# EAGLE design RadioMusic (EAGLE 6.6.0)
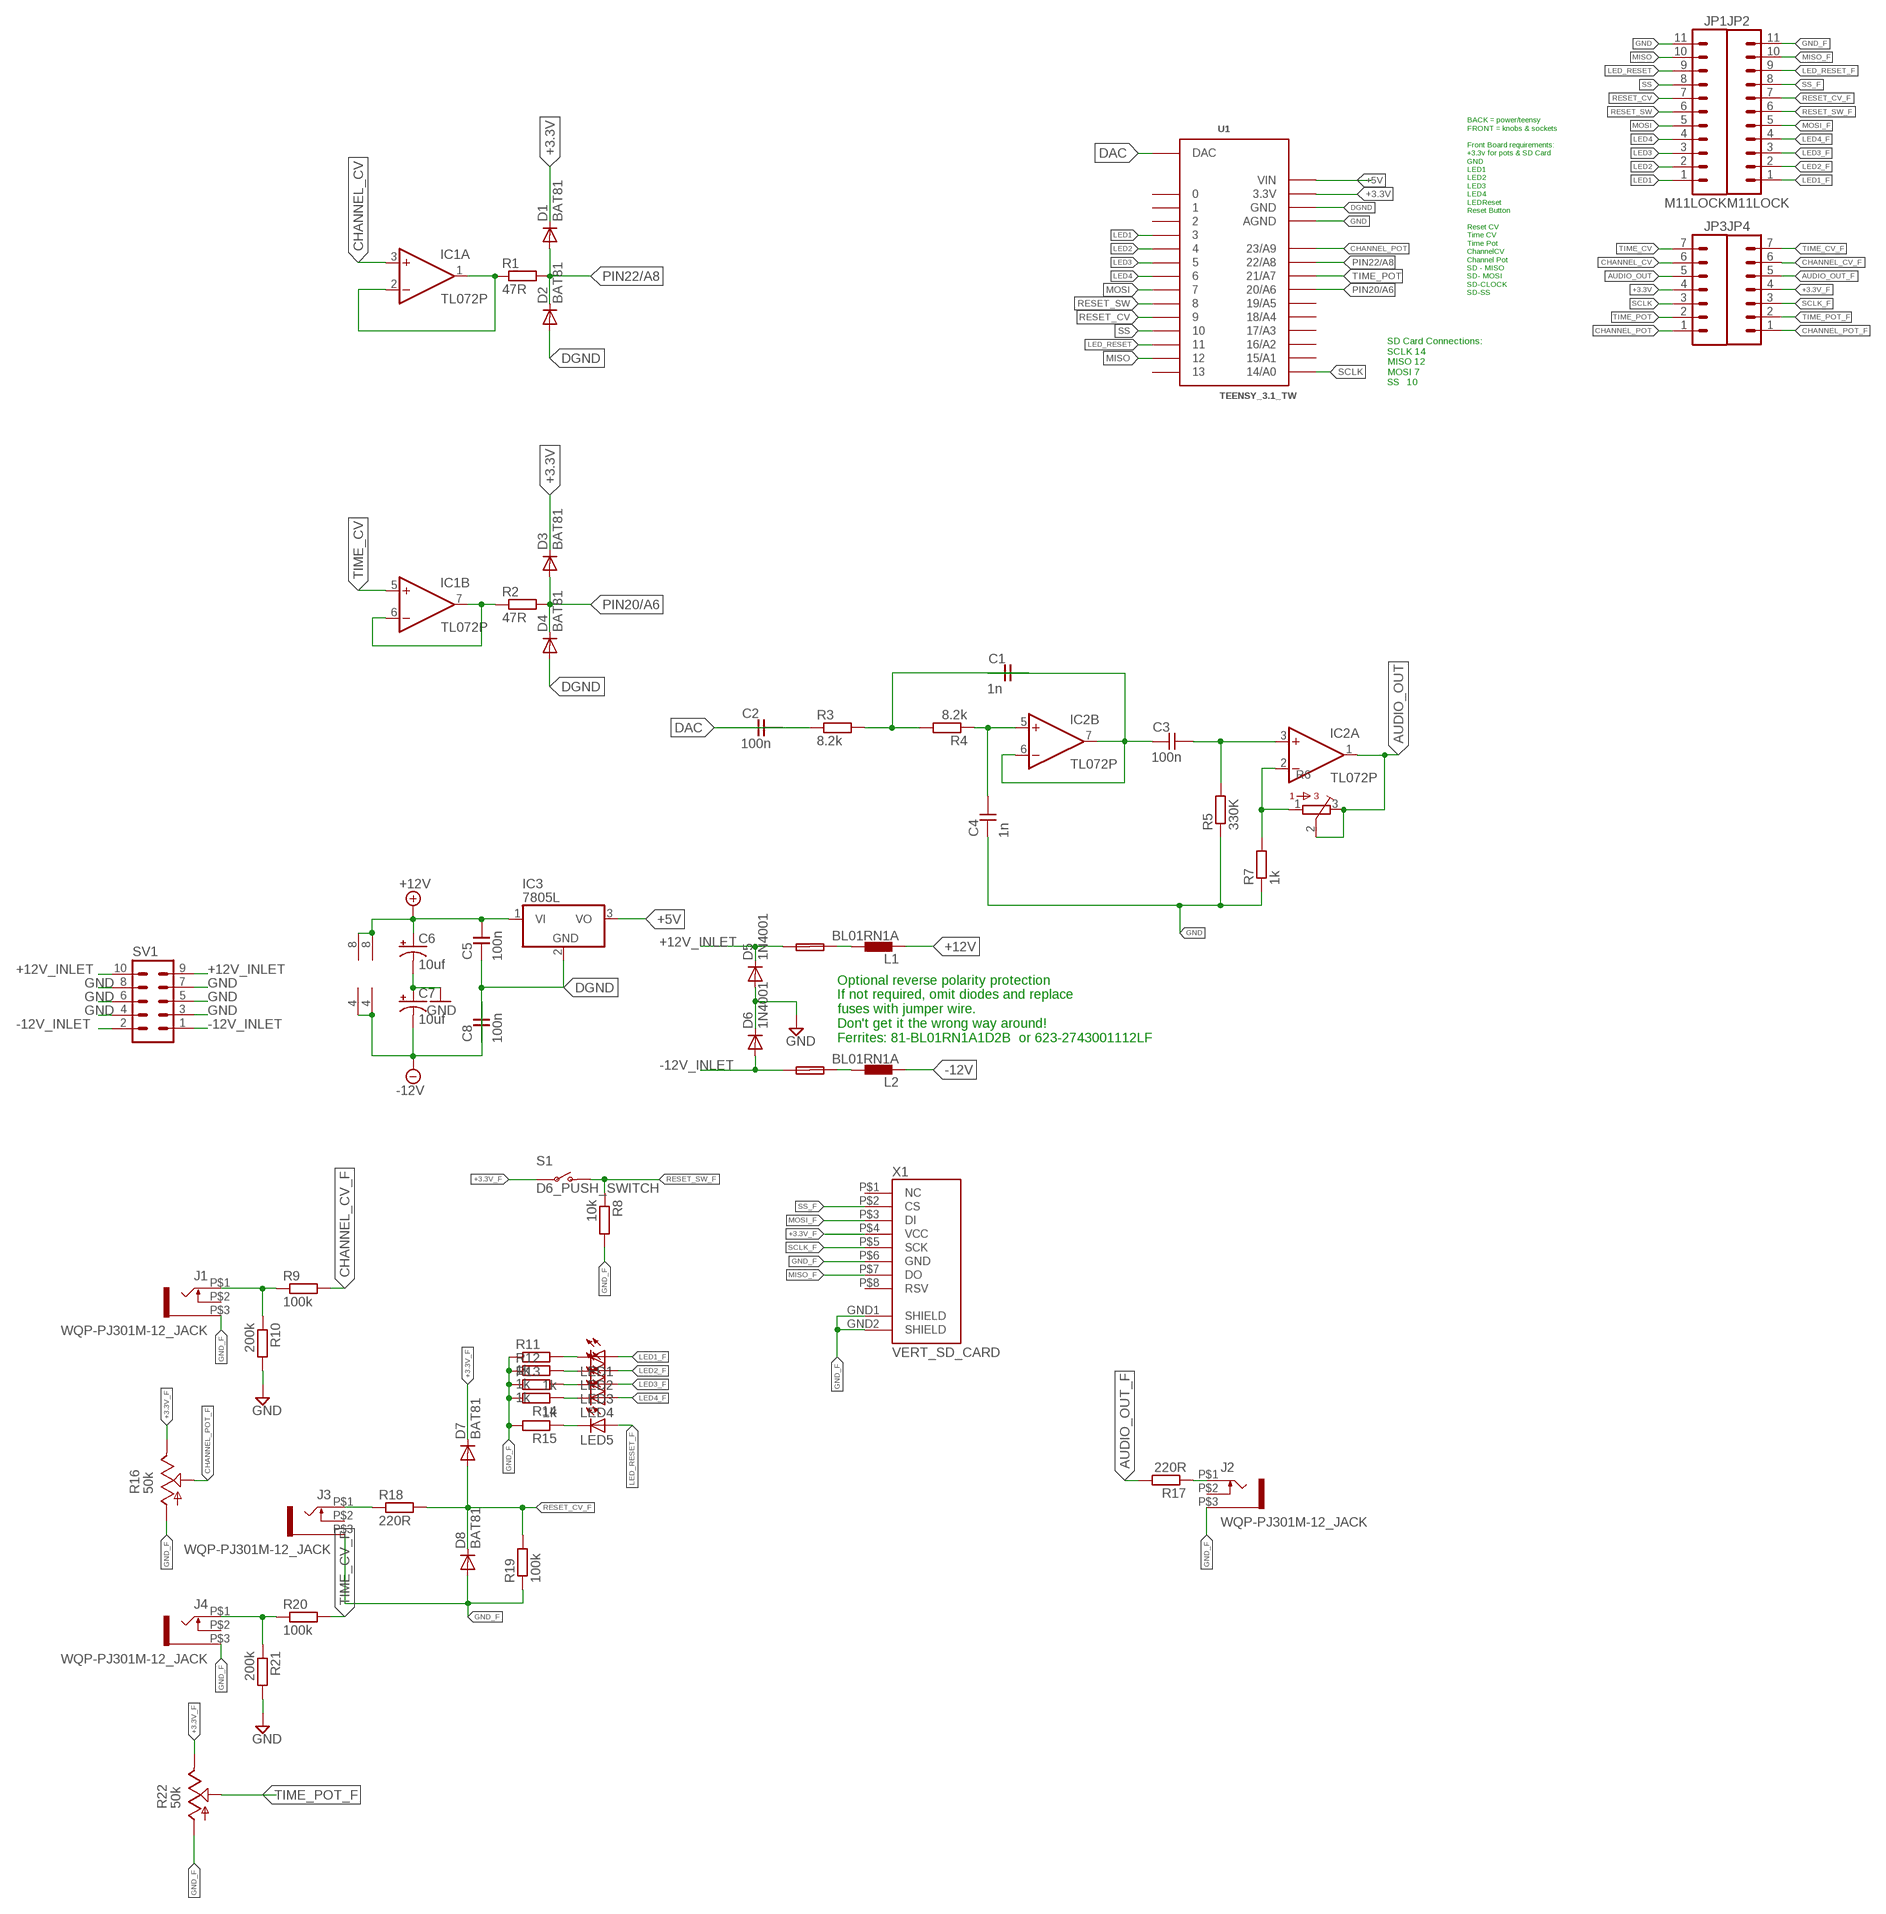
[diagram p0: schematic, sheet 1]

## Parts
C1  1n  C-EU050-024X044  [C050-024X044]
C2  100n  C-EU050-025X075  [C050-025X075]
C3  100n  C-EU050-025X075  [C050-025X075]
C4  1n  C-EU050-024X044  [C050-024X044]
C5  100n  C-EU050-024X044  [C050-024X044]
C6  10uf  CAP_POLPTH2  [CPOL-RADIAL-10UF-25V]
C7  10uf  CAP_POLPTH2  [CPOL-RADIAL-10UF-25V]
C8  100n  C-EU050-024X044  [C050-024X044]
D1  BAT81  [DO34-7]
D2  BAT81  [DO34-7]
D3  BAT81  [DO34-7]
D4  BAT81  [DO34-7]
D5  1N4001  1N4004  [DO41-10]
D6  1N4001  1N4004  [DO41-10]
D7  BAT81  [DO34-7]
D8  BAT81  [DO34-7]
F1  FUSE  PTC_FUSEPOLY_FUSE  [C050H075X075]
F2  FUSE  PTC_FUSEPOLY_FUSE  [C050H075X075]
IC1  TL072P  [DIL08]
IC2  TL072P  [DIL08]
IC3  7805L  [TO92]
J1  WQP-PJ301M-12_JACK  [WQP-PJ301M-12_JACK]
J2  WQP-PJ301M-12_JACK  [WQP-PJ301M-12_JACK]
J3  WQP-PJ301M-12_JACK  [WQP-PJ301M-12_JACK]
J4  WQP-PJ301M-12_JACK  [WQP-PJ301M-12_JACK]
JP1  M11LOCK  [1X11_LOCK]
JP2  M11LOCK  [1X11_LOCK]
JP3  M07LOCK  [1X07_LOCK]
JP4  M07LOCK  [1X07_LOCK]
L1  BL01RN1A  [BL01RN1A]
L2  BL01RN1A  [BL01RN1A]
LED1  LED3MM  [LED3MM]
LED2  LED3MM  [LED3MM]
LED3  LED3MM  [LED3MM]
LED4  LED3MM  [LED3MM]
LED5  LED3MM  [LED3MM]
R1  47R  R-EU_STANDARD_RESISTOR  [0207/10]
R2  47R  R-EU_STANDARD_RESISTOR  [0207/10]
R3  8.2k  R-EU_STANDARD_RESISTOR  [0207/10]
R4  8.2k  R-EU_STANDARD_RESISTOR  [0207/10]
R5  330K  R-EU_STANDARD_RESISTOR  [0207/10]
R6  3362P  [3362P]
R7  1k  R-EU_STANDARD_RESISTOR  [0207/10]
R8  10k  R-EU_STANDARD_RESISTOR  [0207/10]
R9  100k  R-EU_STANDARD_RESISTOR  [0207/10]
R10  200k  R-EU_STANDARD_RESISTOR  [0207/10]
R11  1k  R-EU_STANDARD_RESISTOR  [0207/10]
R12  1k  R-EU_STANDARD_RESISTOR  [0207/10]
R13  1k  R-EU_STANDARD_RESISTOR  [0207/10]
R14  1k  R-EU_STANDARD_RESISTOR  [0207/10]
R15  1k  R-EU_STANDARD_RESISTOR  [0207/10]
R16  50k  ALPHA-9MMF2A  [EVUF]
R17  220R  R-EU_STANDARD_RESISTOR  [0207/10]
R18  220R  R-EU_STANDARD_RESISTOR  [0207/10]
R19  100k  R-EU_STANDARD_RESISTOR  [0207/10]
R20  100k  R-EU_STANDARD_RESISTOR  [0207/10]
R21  200k  R-EU_STANDARD_RESISTOR  [0207/10]
R22  50k  ALPHA-9MMF2A  [EVUF]
S1  D6_PUSH_SWITCH  [D6_BUTTON_RND]
SV1  10_PIN_HEADER  [MA05-2]
U1  TEENSY_3.1_TW  [TEENSY_3.1_TW]
X1  VERT_SD_CARD  [VERT_MICROSD]

## Nets
+3.3V: D1.C D3.C JP3.4 U1.3.3V
+3.3V_F: D7.C JP4.4 R16.3(E) R22.3(E) S1.P$3(P) S1.P$4(P) X1.P$4(VCC)
+5V: IC3.3(VO) U1.VIN
+12V [power]: C5.1 C6.1(+) IC1.8(P:V+) IC2.8(P:V+) IC3.1(VI) L1.1
+12V_INLET [power]: D5.C F1.1 SV1.9 SV1.10
-12V [power]: C7.2(-) C8.1 IC1.4(P:V-) IC2.4(P:V-) L2.1
-12V_INLET [power]: D6.A F2.1 SV1.1 SV1.2
AUDIO_OUT: IC2.1(A:OUT) JP3.5 R6.2 R6.3
AUDIO_OUT_F: JP4.5 R17.2
CHANNEL_CV: IC1.3(A:+IN) JP3.6
CHANNEL_CV_F: JP4.6 R9.2
CHANNEL_POT: JP3.1 U1.23/A9
CHANNEL_POT_F: JP4.1 R16.2(S)
DAC: C2.1 U1.DAC
DGND: C5.2 C8.2 D2.A D4.A IC3.2(GND) U1.GND
GND [ground]: C4.2 C6.2(-) C7.1(+) D5.A D6.C JP1.11 R5.1 R7.1 R10.2 R21.2 SV1.3 SV1.4 SV1.5 SV1.6 SV1.7 SV1.8 U1.AGND
GND_F: D8.A J1.P$3 J2.P$3 J3.P$3 J4.P$3 JP2.11 R8.2 R11.1 R12.1 R13.1 R14.2 R15.2 R16.1(A) R19.1 R22.1(A) X1.GND1(SHIELD) X1.GND2(SHIELD) X1.P$6(GND)
LED1: JP1.1 U1.3
LED1_F: JP2.1 LED1.A
LED2: JP1.2 U1.4
LED2_F: JP2.2 LED2.A
LED3: JP1.3 U1.5
LED3_F: JP2.3 LED3.A
LED4: JP1.4 U1.6
LED4_F: JP2.4 LED4.A
LED_RESET: JP1.9 U1.11
LED_RESET_F: JP2.9 LED5.A
MISO: JP1.10 U1.12
MISO_F: JP2.10 X1.P$7(DO)
MOSI: JP1.5 U1.7
MOSI_F: JP2.5 X1.P$3(DI)
N$1: IC1.6(B:-IN) IC1.7(B:OUT) R2.1
N$2: C4.1 IC2.5(B:+IN) R4.1
N$3: J2.P$1 R17.1
N$4: C1.1 R3.2 R4.2
N$5: C1.2 C3.2 IC2.6(B:-IN) IC2.7(B:OUT)
N$6: C3.1 IC2.3(A:+IN) R5.2
N$7: IC2.2(A:-IN) R6.1 R7.2
N$9: J1.P$1 R9.1 R10.1
N$10: C2.2 R3.1
N$14: J3.P$1 R18.1
N$18: LED1.K(C) R11.2
N$19: LED2.K(C) R12.2
N$20: LED3.K(C) R13.2
N$21: LED4.K(C) R14.1
N$22 [power]: F1.2 L1.2
N$23 [power]: F2.2 L2.2
N$25: LED5.K(C) R15.1
PIN20/A6: D3.A D4.C R2.2 U1.20/A6
PIN22/A8: D1.A D2.C IC1.1(A:OUT) IC1.2(A:-IN) R1.1 R1.2 U1.22/A8
RESET_CV: JP1.7 U1.9
RESET_CV_F: D7.A D8.C JP2.7 R18.2 R19.2
RESET_SW: JP1.6 U1.8
RESET_SW_F: JP2.6 R8.1 S1.P$1(O) S1.P$2(O)
SCLK: JP3.3 U1.14/A0
SCLK_F: JP4.3 X1.P$5(SCK)
SS: JP1.8 U1.10
SS_F: JP2.8 X1.P$2(CS)
TEMP: J4.P$1 R20.1 R21.1
TIME_CV: IC1.5(B:+IN) JP3.7
TIME_CV_F: JP4.7 R20.2
TIME_POT: JP3.2 U1.21/A7
TIME_POT_F: JP4.2 R22.2(S)
Unconnected: J1.P$2 J2.P$2 J3.P$2 J4.P$2 U1.0 U1.1 U1.2 U1.13 U1.15/A1 U1.16/A2 U1.17/A3 U1.18/A4 U1.19/A5 X1.P$1(NC) X1.P$8(RSV)

## Notes on the sheet
- BACK = power/teensy
  FRONT = knobs & sockets
  
  Front Board requirements:
  +3.3v for pots & SD Card 
  GND 
  LED1
  LED2
  LED3
  LED4
  LEDReset
  Reset Button
  
  Reset CV 
  Time CV
  Time Pot
  ChannelCV
  Channel Pot
  SD - MISO
  SD- MOSI
  SD-CLOCK
  SD-SS
- SD Card Connections: 
   SCLK 14
   MISO 12
   MOSI 7 
   SS   10
- Optional reverse polarity protection
  If not required, omit diodes and replace
  fuses with jumper wire. 
  Don't get it the wrong way around! 
  Ferrites: 81-BL01RN1A1D2B  or 623-2743001112LF

## Library data of the parts
C1-C5 C8 = TomW:C-EU: CAPACITOR, European symbol
C6 C7 = SparkFun-Passives:CAP_POL: Capacitor Polarized These are standard SMD and PTH capacitors. Normally 10uF, 47uF, and 100uF in electrolytic and tantalum varieties. Always verify the external diameter of the through hole cap, it varies with capacity, voltage, and manufacturer. The EIA devices should be standard.
D1-D4 D7 D8 = diode:BAT81: DIODE barrier diode
D5 D6 = diode:1N4004: DIODE general purpose rectifier, 1 A
F1 F2 = TomW:PTC_FUSE
IC1 IC2 = TomW:TL072: OP AMP
IC3 = gm-regulators:78*: Positive VOLTAGE REGULATOR Source: http://cache.national.com/ds/LM/LM78L05.pdf http://www.fairchildsemi.com/ds/LM/LM7805.pdf
J1-J4 = thonkiconn:WQP-PJ301M-12_JACK
JP1 JP2 = SparkFun-Connectors:M11: Header 11 Standard 11-pin 0.1" header. Use with straight break away headers (SKU : PRT-00116), right angle break away headers (PRT-00553), swiss pins (PRT-00743), machine pins (PRT-00117), and female headers (PRT-00115).
JP3 JP4 = SparkFun-Connectors:M07: Header 7 Standard 7-pin 0.1" header. Use with straight break away headers (SKU : PRT-00116), right angle break away headers (PRT-00553), swiss pins (PRT-00743), machine pins (PRT-00117), and female headers (PRT-00115). NOTES ON THE VARIANTS LOCK and LOCK_LONGPADS... This footprint was designed to help hold the alignment of a through-hole component (i.e. 7-pin header) while soldering it into place. You may notice that each hole has been shifted either up or down by 0.005 of an inch from it's more standard position (which is usually a perfectly straight line). This slight alteration caused the pins (the squares in the middle) to touch the edges of the holes. Because they are alternating, it causes a "brace" to hold the header in place. 0.005 has proven to be the perfect amount of "off-center" position when using our standard breakaway headers. Although looks a little odd when you look at the bare footprint, once you have a header in there, the alteration is very hard to notice. Also, if you push a header all the way into place, it is covered up entirely on the bottom side. This idea of altering the position of holes to aid alignment will be further integrated into the Sparkfun Library for other footprints. It can help hold any component with 3 or more connection pins.
L1 L2 = inductors:BL0: Noise Suppression Products/EMI Suppression Filters, Lead EMIFIL(R) Inductor Type Source: http://www.murata.com .. BL01RN1_DS.pdf
LED1-LED5 = TomW:LED: LED OSRAM: - CHIPLED LG R971, LG N971, LY N971, LG Q971, LY Q971, LO R971, LY R971 LH N974, LH R974 LS Q976, LO Q976, LY Q976 LO Q996 - Hyper CHIPLED LW Q18S LB Q993, LB Q99A, LB R99A - SideLED LS A670, LO A670, LY A670, LG A670, LP A670 LB A673, LV A673, LT A673, LW A673 LH A674 LY A675 LS A676, LA A676, LO A676, LY A676, LW A676 LS A679, LY A679, LG A679 - Hyper Micro SIDELED® LS Y876, LA Y876, LO Y876, LY Y876 LT Y87S - SmartLED LW L88C, LW L88S LB L89C, LB L89S, LG L890 LS L89K, LO L89K, LY L89K LS L896, LA L896, LO L896, LY L896 - TOPLED LS T670, LO T670, LY T670, LG T670, LP T670 LSG T670, LSP T670, LSY T670, LOP T670, LYG T670 LG T671, LOG T671, LSG T671 LB T673, LV T673, LT T673, LW T673 LH T674 LS T676, LA T676, LO T676, LY T676, LB T676, LH T676, LSB T676, LW T676 LB T67C, LV T67C, LT T67C, LS T67K, LO T67K, LY T67K, LW E67C LS E67B, LA E67B, LO E67B, LY E67B, LB E67C, LV E67C, LT E67C LW T67C LS T679, LY T679, LG T679 LS T770, LO T770, LY T770, LG T770, LP T770 LB T773, LV T773, LT T773, LW T773 LH T774 LS E675, LA E675, LY E675, LS T675 LS T776, LA T776, LO T776, LY T776, LB T776 LHGB T686 LT T68C, LB T68C - Hyper Mini TOPLED® LB M676 - Mini TOPLED Santana® LG M470 LS M47K, LO M47K, LY M47K Source: http://www.osram.convergy.de LUXEON: - LUMILED® LXK2-PW12-R00, LXK2-PW12-S00, LXK2-PW14-U00, LXK2-PW14-V00 LXK2-PM12-R00, LXK2-PM12-S00, LXK2-PM14-U00 LXK2-PE12-Q00, LXK2-PE12-R00, LXK2-PE12-S00, LXK2-PE14-T00, LXK2-PE14-U00 LXK2-PB12-K00, LXK2-PB12-L00, LXK2-PB12-M00, LXK2-PB14-N00, LXK2-PB14-P00, LXK2-PB14-Q00 LXK2-PR12-L00, LXK2-PR12-M00, LXK2-PR14-Q00, LXK2-PR14-R00 LXK2-PD12-Q00, LXK2-PD12-R00, LXK2-PD12-S00 LXK2-PH12-R00, LXK2-PH12-S00 LXK2-PL12-P00, LXK2-PL12-Q00, LXK2-PL12-R00 Source: www.luxeon.com KINGBRIGHT: KA-3528ASYC Source: www.kingbright.com
R1-R5 R7-R15 R17-R21 = TomW:R-EU_: RESISTOR, European symbol
R6 = bourns:3362: 3362 Series 1/4" Square Trimmer
R16 R22 = TomW:ALPHA-9MM: 9 mm Square Rotary Potentiometers Source: Panasonic
S1 = TomW:D6_PUSH_SWITCH
SV1 = TomW:10_PIN_HEADER: PIN HEADER; OC_FARNELL: unknown; OC_NEWARK: unknown
U1 = TomW:TEENSY_3.1_TW: Basic Teensy 3.0 with none of the 'inner' pins enabled. See '+4', 'AllAnalogPins", and 'AllPins' packages for additional pin holes, as needed.
X1 = TomW:VERT_SD_CARD

## Net classes
0 default: width 0.203 mm
1 power: width 0.305 mm
2 ground: width 0.305 mm

## Board
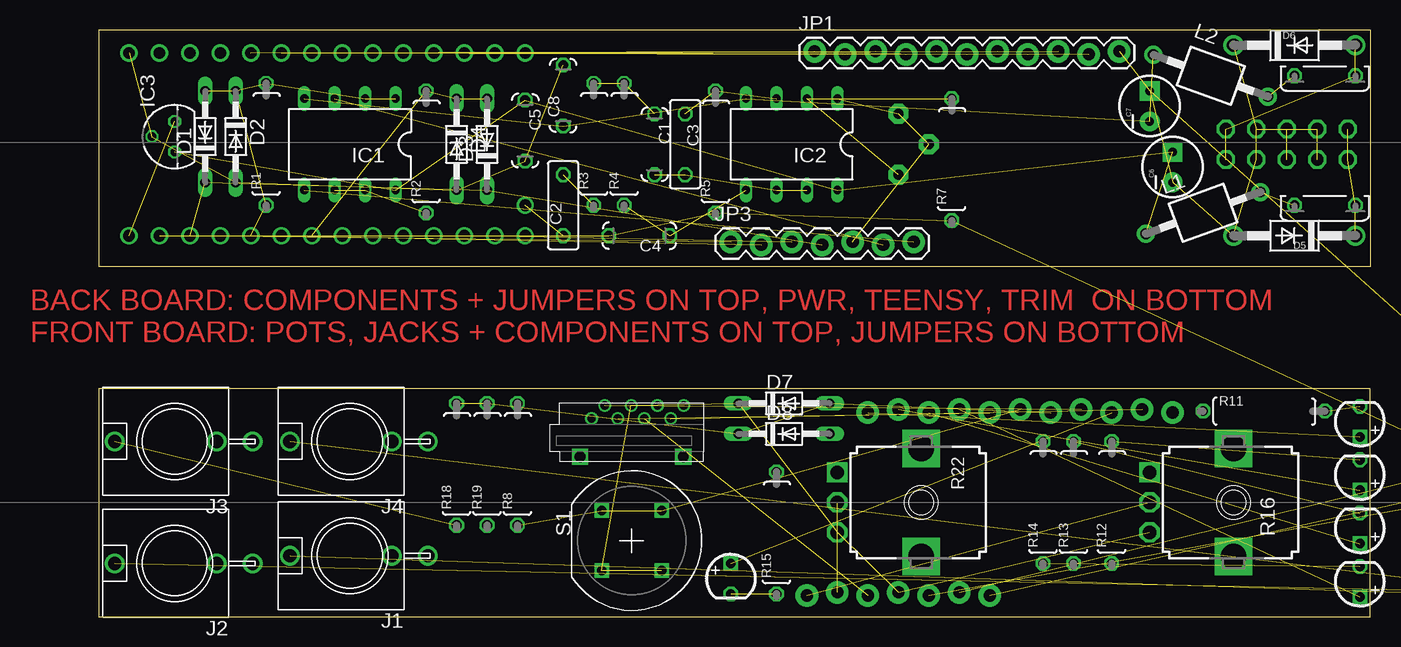
[diagram p1: board, top side]
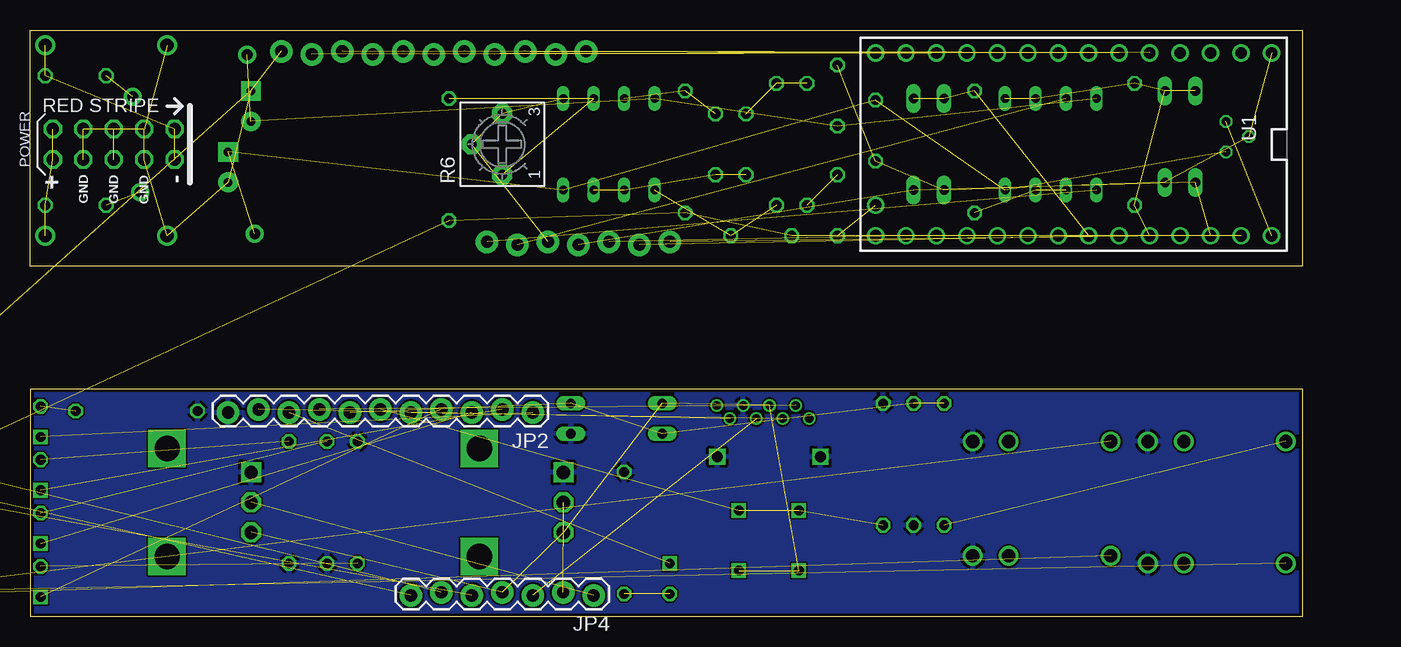
[diagram p2: board, bottom side, seen from below]

Size 106.05 x 48.9 mm. Coordinates in mm from the lower left corner, seen from the top.
Outline: 0,19 0,0 106,0 106,19 0,19
Outline: 0,48.9 0,29.21 106.05,29.21 106.05,48.9 0,48.9
Copper layers (1*2*15*16): Top 0.035mm / dielectric 0.2mm / Route2 0.0175mm / dielectric 1.1mm / Route15 0.0175mm / dielectric 0.2mm / Bottom 0.035mm
Design rules "SeeedStudio_DRU_no_angle_20130527": minimum track width 6mil, minimum drill 12mil, track to track 6mil, track to pad 6mil, pad to pad 6mil, via to via 6mil, smd to smd 0mil, copper to edge 10mil, drill to drill 10mil, minimum pad ring 6mil, minimum via ring 6mil, stop-mask expansion 2mil, vias tented up to drill 25mil, thermal gap 10mil

### Footprints (pad centres in the part's own frame; a part is rotated, then mirrored left to right if it is on the bottom)
C050-024X044 = drill 0.813 octagon: 1 -2.54,0; 2 2.54,0
C050-025X075 = drill 0.813 octagon: 1 -2.54,0; 2 2.54,0
CPOL-RADIAL-10UF-25V = drill 0.7 pad 1.651 square: 1 1.27,0 | drill 0.7 pad 1.651: 2 -1.27,0
DO34-7 = drill 0.813 long: A 3.81,0; C -3.81,0
DO41-10 = drill 1.118: A 5.08,0; C -5.08,0
C050H075X075 = drill 0.813 octagon: 1 -2.54,0; 2 2.54,0
DIL08 = drill 0.7 long: 1 -3.81,-3.81; 2 -1.27,-3.81; 3 1.27,-3.81; 4 3.81,-3.81; 5 3.81,3.81; 6 1.27,3.81; 7 -1.27,3.81; 8 -3.81,3.81
TO92 = drill 0.7 octagon: 1 -1.27,0; 2 0,1.905; 3 1.27,0
WQP-PJ301M-12_JACK = drill 1.1: P$1 0,5; P$2 0,-3.5; P$3 0,-6.5
1X11_LOCK = drill 1.016 pad 1.88: 1 0,0.127; 2 2.54,-0.127; 3 5.08,0.127; 4 7.62,-0.127; 5 10.16,0.127; 6 12.7,-0.127; 7 15.24,0.127; 8 17.78,-0.127; 9 20.32,0.127; 10 22.86,-0.127; 11 25.4,0.127
1X07_LOCK = drill 1.016 pad 1.88: 1 0,0.127; 2 2.54,-0.127; 3 5.08,0.127; 4 7.62,-0.127; 5 10.16,0.127; 6 12.7,-0.127; 7 15.24,0.127
BL01RN1A = drill 0.9 pad 1.5: 1 -5.08,0; 2 5.08,0
LED3MM = drill 0.813 square: A -1.27,0 | drill 0.813 octagon: K 1.27,0
0207/10 = drill 0.813 octagon: 1 -5.08,0; 2 5.08,0
3362P = drill 0.813 pad 1.676 octagon: 1 -2.54,0; 2 0,2.54; 3 2.54,0
EVUF = drill 1.1 pad 1.676 square: 1 -2.5,-7 | drill 1.1 pad 1.676 octagon: 2 0,-7; 3 2.5,-7 | drill 2.1 pad 2.8 square: M1 4.5,0; M2 -4.5,0
D6_BUTTON_RND = drill 0.81 square: P$1 -2.5,2.5; P$2 2.5,2.5; P$3 2.5,-2.5; P$4 -2.5,-2.5
MA05-2 = drill 1.016 octagon: 1 -5.08,-1.27; 2 -5.08,1.27; 3 -2.54,-1.27; 4 -2.54,1.27; 5 0,-1.27; 6 0,1.27; 7 2.54,-1.27; 8 2.54,1.27; 9 5.08,-1.27; 10 5.08,1.27
TEENSY_3.1_TW = drill 0.965: 0 -7.62,13.97; 1 -7.62,11.43; 2 -7.62,8.89; 3 -7.62,6.35; 3.3V 7.62,11.43; 4 -7.62,3.81; 5 -7.62,1.27; 6 -7.62,-1.27; 7 -7.62,-3.81; 8 -7.62,-6.35; 9 -7.62,-8.89; 10 -7.62,-11.43; 11 -7.62,-13.97; 12 -7.62,-16.51; 13 7.62,-16.51; 14/A0 7.62,-13.97; 15/A1 7.62,-11.43; 16/A2 7.62,-8.89; 17/A3 7.62,-6.35; 18/A4 7.62,-3.81; 19/A5 7.62,-1.27; 20/A6 7.62,1.27; 21/A7 7.62,3.81; 22/A8 7.62,6.35; 23/A9 7.62,8.89; AGND 7.62,13.97; DAC 5.08,-16.51; GND -7.62,16.51; VIN 7.62,16.51
VERT_MICROSD = drill 0.9 square: GND1 -4.3,-3.17; GND2 4.3,-3.17 | drill 0.7: P$1 -3.35,0; P$2 -2.25,1.1; P$3 -1.15,0; P$4 -0.05,1.1; P$5 1.05,0; P$6 2.15,1.1; P$7 3.25,0; P$8 4.35,1.1

### Placement (x,y rotation side)
C1  46.35,39.37 270 top
C2  38.73,34.29 90 top
C3  48.9,39.37 270 top
C4  45.09,31.75 180 top
C5  35.56,40.51 270 top
C6  89.53,37.47 90 top
C7  87.63,42.55 90 top
C8  38.73,43.43 90 top
D1  8.89,40.01 90 top
D2  11.43,40.01 270 top
D3  32.38,39.37 90 top
D4  29.84,39.37 270 top
D5  99.69,31.75 180 top
D6  99.69,47.62 0 top
D7  57.15,17.78 0 top
D8  57.15,15.24 0 top
F1  102.23,34.29 180 top
F2  102.23,45.09 180 top
IC1  20.95,39.37 180 top
IC2  57.78,39.37 180 top
IC3  6.35,40.01 90 top
J1  20.95,5.08 90 top
J2  6.35,4.45 90 top
J3  6.35,14.61 90 top
J4  20.95,14.61 90 top
JP1  59.69,46.99 0 top
JP2  64.14,17.14 180 bottom
JP3  52.7,31.11 0 top
JP4  59.05,1.91 180 bottom
L1  92.08,33.66 20 top
L2  92.71,45.09 340 top
LED1  105.16,16.26 90 top
LED2  105.16,11.81 90 top
LED3  105.16,7.37 90 top
LED4  105.16,2.92 90 top
LED5  52.7,3.17 270 top
R1  13.97,39.37 90 top
R2  27.3,38.73 90 top
R3  41.27,39.37 90 top
R4  43.81,39.37 90 top
R5  51.44,38.73 90 top
R6  66.67,39.37 90 bottom
R7  71.12,38.1 90 top
R8  34.92,12.7 90 top
R9  112.39,6.99 90 top  (outside the outline)
R10  116.2,6.99 90 top  (outside the outline)
R11  97.16,17.14 0 top
R12  84.45,9.53 90 top
R13  81.28,9.53 90 top
R14  78.74,9.53 90 top
R15  56.52,6.99 90 top
R16  94.61,9.53 270 top
R17  125.73,6.99 90 top  (outside the outline)
R18  29.84,12.7 90 top
R19  32.38,12.7 90 top
R20  120.02,6.99 90 top  (outside the outline)
R21  123.19,6.99 90 top  (outside the outline)
R22  68.58,9.53 270 top
S1  44.45,6.35 0 top
SV1  99.06,39.37 180 bottom
U1  19.05,39.37 270 bottom
U$2  [MTM_2CM_SCREEN_200DPI]  110.49,18.03 0 top  (outside the outline)
X1  44.45,16.51 0 top

### Tracks (layer width: path | path; a pad name or v marks a point on that pad's centre or on a via)
+3.3V  (3 unrouted)
+3.3V_F  (6 unrouted)
+5V  (1 unrouted)
+12V  (5 unrouted)
+12V_INLET  (3 unrouted)
-12V  (4 unrouted)
-12V_INLET  (3 unrouted)
AUDIO_OUT  (3 unrouted)
AUDIO_OUT_F  (1 unrouted)
CHANNEL_CV  (1 unrouted)
CHANNEL_CV_F  (1 unrouted)
CHANNEL_POT  (1 unrouted)
CHANNEL_POT_F  (1 unrouted)
DAC  (1 unrouted)
DGND  (5 unrouted)
GND  (16 unrouted)
GND_F
  pour Bottom: -1.27,20.32 107.95,20.32 107.95,-1.91 -1.91,-1.91 -1.91,20.32
LED1  (1 unrouted)
LED1_F  (1 unrouted)
LED2  (1 unrouted)
LED2_F  (1 unrouted)
LED3  (1 unrouted)
LED3_F  (1 unrouted)
LED4  (1 unrouted)
LED4_F  (1 unrouted)
LED_RESET  (1 unrouted)
LED_RESET_F  (1 unrouted)
MISO  (1 unrouted)
MISO_F  (1 unrouted)
MOSI  (1 unrouted)
MOSI_F  (1 unrouted)
N$1  (2 unrouted)
N$2  (2 unrouted)
N$3  (1 unrouted)
N$4  (2 unrouted)
N$5  (3 unrouted)
N$6  (2 unrouted)
N$7  (2 unrouted)
N$9  (2 unrouted)
N$10  (1 unrouted)
N$14  (1 unrouted)
N$18  (1 unrouted)
N$19  (1 unrouted)
N$20  (1 unrouted)
N$21  (1 unrouted)
N$22  (1 unrouted)
N$23  (1 unrouted)
N$25  (1 unrouted)
PIN20/A6  (3 unrouted)
PIN22/A8  (6 unrouted)
RESET_CV  (1 unrouted)
RESET_CV_F  (4 unrouted)
RESET_SW  (1 unrouted)
RESET_SW_F  (3 unrouted)
SCLK  (1 unrouted)
SCLK_F  (1 unrouted)
SS  (1 unrouted)
SS_F  (1 unrouted)
TEMP  (2 unrouted)
TIME_CV  (1 unrouted)
TIME_CV_F  (1 unrouted)
TIME_POT  (1 unrouted)
TIME_POT_F  (1 unrouted)

### Text on the board
Top: BACK BOARD: COMPONENTS + JUMPERS ON TOP, PWR, TEENSY, TRIM ON BOTTOM / FRONT BOARD: POTS, JACKS + COMPONENTS ON TOP, JUMPERS ON BOTTOM